# Altium schematic sheet Limit_Switches.SchDoc: RP2040 CNC
size B; Author: AM; CompanyName: Expatria Technologies; DrawnBy: A.Marles; Engineer: AM; Organization: Expatria Technolgoies; DocumentNumber: 7; SheetNumber: 7; SheetTotal: 14
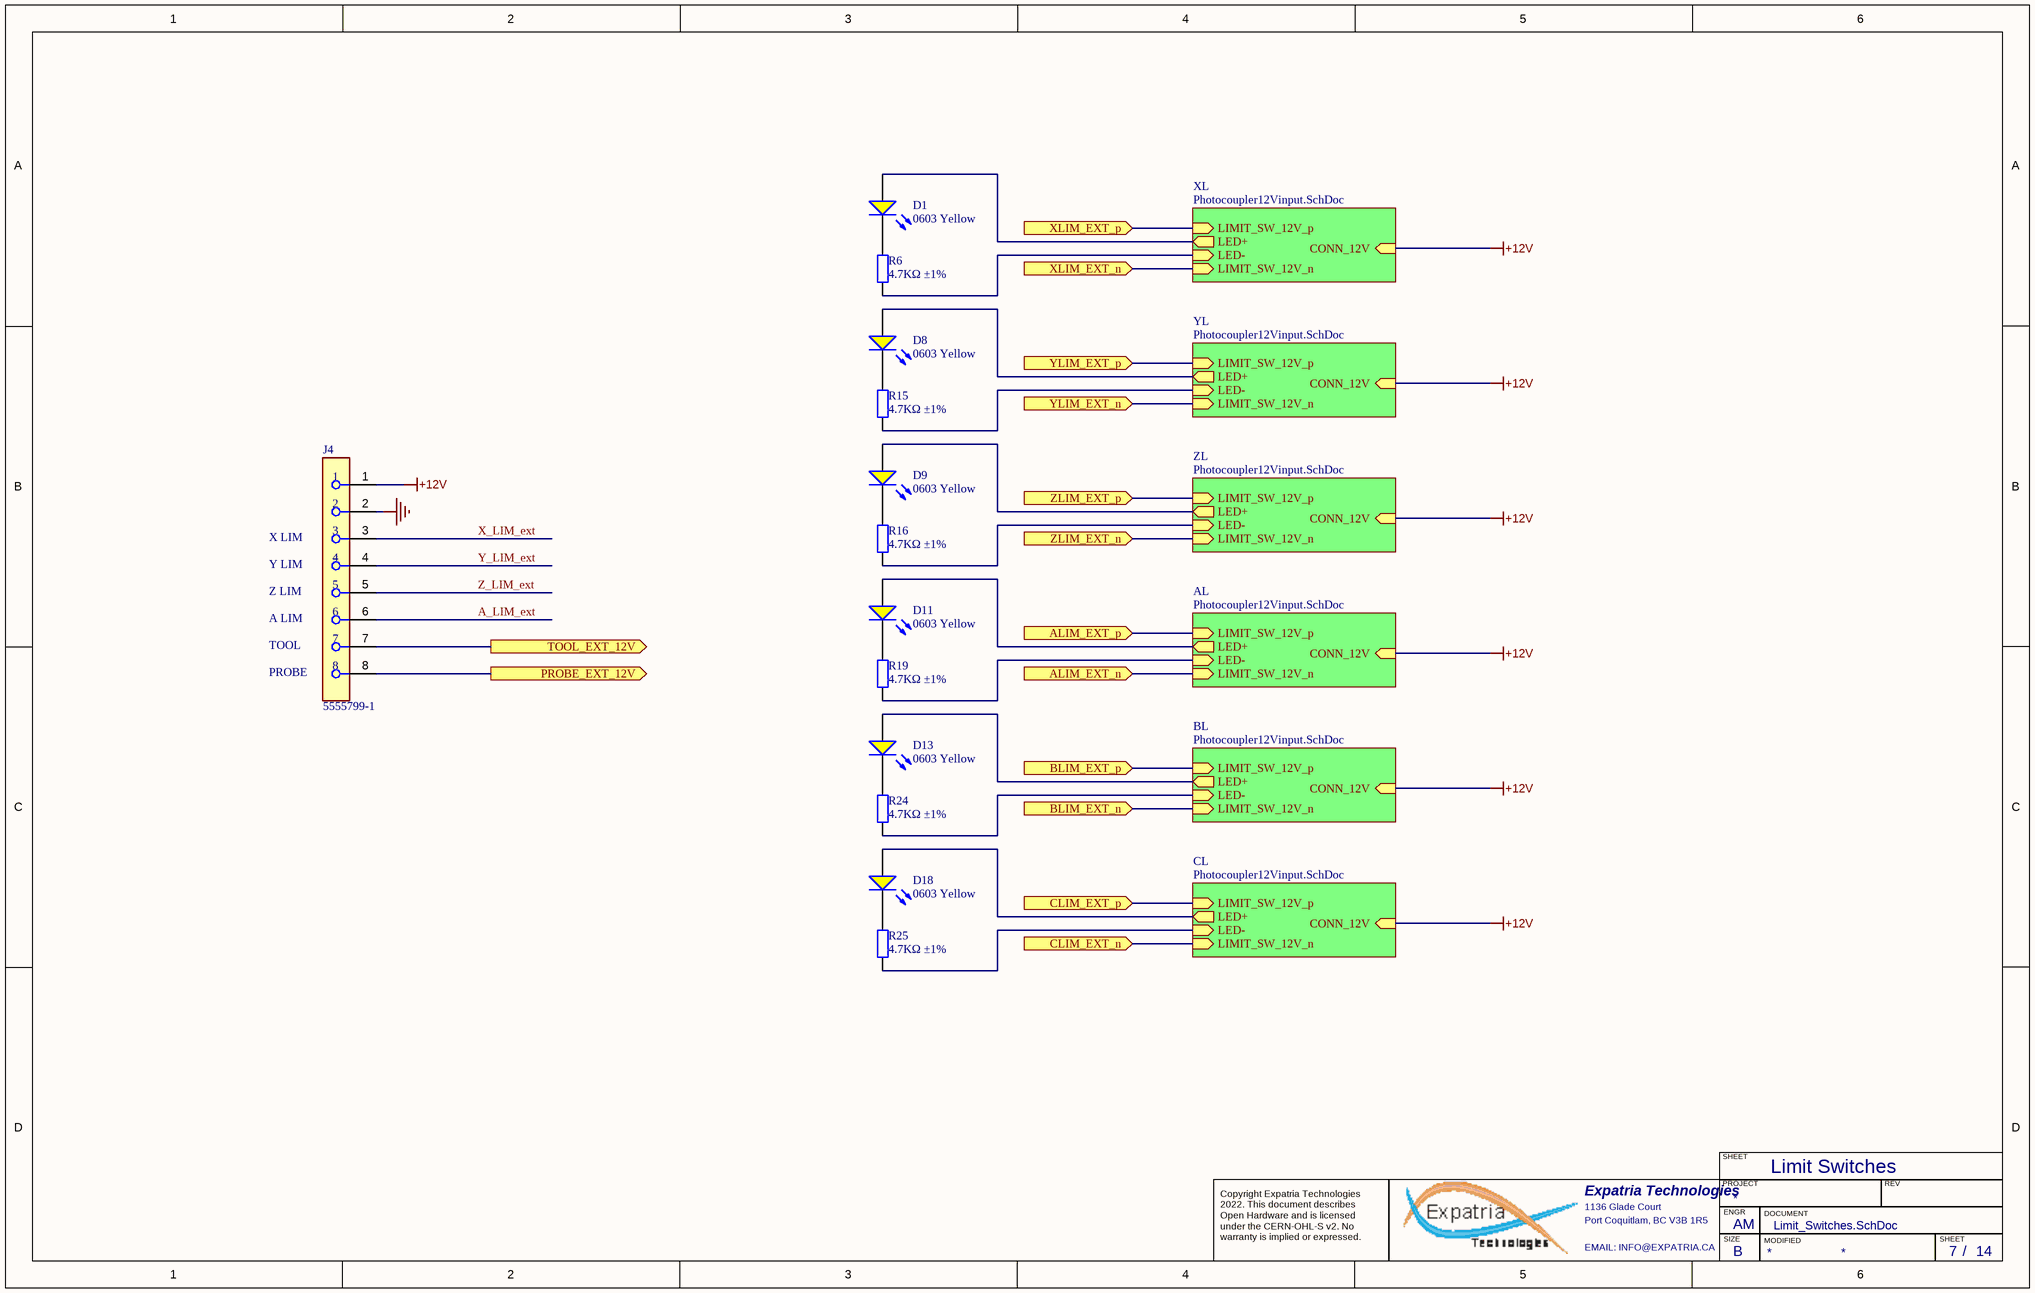
[diagram p0: Limit_Switches.SchDoc]

## Parts
D1  0603 Yellow  [0603_LED_S1]
D8  0603 Yellow  [0603_LED_S1]
D9  0603 Yellow  [0603_LED_S1]
D11  0603 Yellow  [0603_LED_S1]
D13  0603 Yellow  [0603_LED_S1]
D18  0603 Yellow  [0603_LED_S1]
J4  5555799-1  [FP-5555799-1-MFG]
R6  4.7KΩ ±1%  [0603_R]
R15  4.7KΩ ±1%  [0603_R]
R16  4.7KΩ ±1%  [0603_R]
R19  4.7KΩ ±1%  [0603_R]
R24  4.7KΩ ±1%  [0603_R]
R25  4.7KΩ ±1%  [0603_R]

## Sub-sheets
AL = Photocoupler12Vinput.SchDoc: LED+ (out), LED- (in), LIMIT_SW_12V_n (in), LIMIT_SW_12V_p (in), CONN_12V (in)
BL = Photocoupler12Vinput.SchDoc: LED+ (out), LED- (in), LIMIT_SW_12V_n (in), LIMIT_SW_12V_p (in), CONN_12V (in)
CL = Photocoupler12Vinput.SchDoc: LED+ (out), LED- (in), LIMIT_SW_12V_n (in), LIMIT_SW_12V_p (in), CONN_12V (in)
XL = Photocoupler12Vinput.SchDoc: LED+ (out), LED- (in), LIMIT_SW_12V_n (in), LIMIT_SW_12V_p (in), CONN_12V (in)
YL = Photocoupler12Vinput.SchDoc: LED+ (out), LED- (in), LIMIT_SW_12V_n (in), LIMIT_SW_12V_p (in), CONN_12V (in)
ZL = Photocoupler12Vinput.SchDoc: LED+ (out), LED- (in), LIMIT_SW_12V_n (in), LIMIT_SW_12V_p (in), CONN_12V (in)

## Ports
ALIM_EXT_n (in), ALIM_EXT_p (in), BLIM_EXT_n (in), BLIM_EXT_p (in), CLIM_EXT_n (in), CLIM_EXT_p (in), PROBE_EXT_12V (out), TOOL_EXT_12V (out), XLIM_EXT_n (in), XLIM_EXT_p (in), YLIM_EXT_n (in), YLIM_EXT_p (in), ZLIM_EXT_n (in), ZLIM_EXT_p (in)

## Nets
+12V: J4.1 ; sheet XL/CONN_12V, sheet YL/CONN_12V, sheet ZL/CONN_12V, sheet AL/CONN_12V, sheet BL/CONN_12V, sheet CL/CONN_12V
GND: J4.2
A_LIM_ext: J4.6
ALIM_EXT_n: port ALIM_EXT_n, sheet AL/LIMIT_SW_12V_n
ALIM_EXT_p: port ALIM_EXT_p, sheet AL/LIMIT_SW_12V_p
BLIM_EXT_n: port BLIM_EXT_n, sheet BL/LIMIT_SW_12V_n
BLIM_EXT_p: port BLIM_EXT_p, sheet BL/LIMIT_SW_12V_p
CLIM_EXT_n: port CLIM_EXT_n, sheet CL/LIMIT_SW_12V_n
CLIM_EXT_p: port CLIM_EXT_p, sheet CL/LIMIT_SW_12V_p
PROBE_EXT_12V: J4.8 ; port PROBE_EXT_12V
TOOL_EXT_12V: J4.7 ; port TOOL_EXT_12V
X_LIM_ext: J4.3
XLIM_EXT_n: port XLIM_EXT_n, sheet XL/LIMIT_SW_12V_n
XLIM_EXT_p: port XLIM_EXT_p, sheet XL/LIMIT_SW_12V_p
Y_LIM_ext: J4.4
YLIM_EXT_n: port YLIM_EXT_n, sheet YL/LIMIT_SW_12V_n
YLIM_EXT_p: port YLIM_EXT_p, sheet YL/LIMIT_SW_12V_p
Z_LIM_ext: J4.5
ZLIM_EXT_n: port ZLIM_EXT_n, sheet ZL/LIMIT_SW_12V_n
ZLIM_EXT_p: port ZLIM_EXT_p, sheet ZL/LIMIT_SW_12V_p
NetD1_A: D1.A ; sheet XL/LED+
NetD1_K: D1.K R6.1
NetD8_A: D8.A ; sheet YL/LED+
NetD8_K: D8.K R15.1
NetD9_A: D9.A ; sheet ZL/LED+
NetD9_K: D9.K R16.1
NetD11_A: D11.A ; sheet AL/LED+
NetD11_K: D11.K R19.1
NetD13_A: D13.A ; sheet BL/LED+
NetD13_K: D13.K R24.1
NetD18_A: D18.A ; sheet CL/LED+
NetD18_K: D18.K R25.1
NetR6_2: R6.2 ; sheet XL/LED-
NetR15_2: R15.2 ; sheet YL/LED-
NetR16_2: R16.2 ; sheet ZL/LED-
NetR19_2: R19.2 ; sheet AL/LED-
NetR24_2: R24.2 ; sheet BL/LED-
NetR25_2: R25.2 ; sheet CL/LED-

## Notes on the sheet
- (near J4) X LIM
- (near J4) Y LIM
- (near J4) Z LIM
- (near J4) A LIM
- TOOL
- (near J4) PROBE
- Limit Switches
- SHEET
- Expatria Technologies
- 1136 Glade Court
- Port Coquitlam, BC V3B 1R5
- PROJECT
- SIZE
- ENGR
- MODIFIED
- DOCUMENT
- REV
- Copyright Expatria Technologies 2022. This document describes Open Hardware and is licensed under the CERN-OHL-S v2. No warranty is implied or expressed.
- EMAIL: INFO@EXPATRIA.CA
- B
- /

## Library data of the parts
D1 D8 D9 D11 D13 D18 = 0603 LED Yellow: LED; ComponentLink1Description: 供应商链接; ComponentLink1URL: http://www.szlcsc.com/product/details_73147.html; Package: 0603; Supplier: LC; SuppliersPartNumber: C72038; Color: Yellow
J4 = CMP-03371-000003-1: CONN MOD JACK 8P8C VERT UNSHLD; Manufacturer: TE Connectivity; Pitch: 2.54mm; Number Of Contacts: 8; Is Female: yes; Device Class L3: unset; Manufacturer Part Number: 5555799-1; Temperature Range High: +85°C; Temperature Range Low: -40°C; Octopart: https://octopart.com/5555799-1-te+connectivity-39526335; Device Class L1: Connectors; Device Class L2: Modular / Ethernet Connectors; Mouser Description: Conn RJ-45 F 8 POS 2.54mm Solder ST Thru-Hole 8 Terminal 1 Port Cat 3 Box/Package/Tray; Digikey Description: CONN MOD JACK 8P8C VERT UNSHLD; Package: 5555799-1; Temperature: -40°C to +85°C; SuppliersPartNumber: C305983
R6 R15 R16 R19 R24 R25 = 0603 4.7K (4701) 1%: Chip resistor; Manufacturer: Uniroyal Elec; PartNumber: 0603WAF4701T5E; Power: 1/10W; ComponentLink1Description: Supplier link; ComponentLink1URL: http://www.szlcsc.com/product/details_23889.html; Package: 0603; Supplier: LC; SuppliersPartNumber: C23162; Resistance: 4.7KΩ; Tolerance: 1%